# Altium schematic sheet config-bank1.SchDoc: Config FPGA - Bank 1
size Letter; CheckedBy: E. Chiu; CompanyName: Brinton Engineering, LLC; DrawnBy: J. Brinton; Engineer: J. Brinton; Address1: 3479 Edison Way; Address2: Menlo Park CA 94025; Address3: +1 (877) 778-8435; Address4: brintonengineering.com; Revision: 1; SheetNumber: 19; SheetTotal: 71
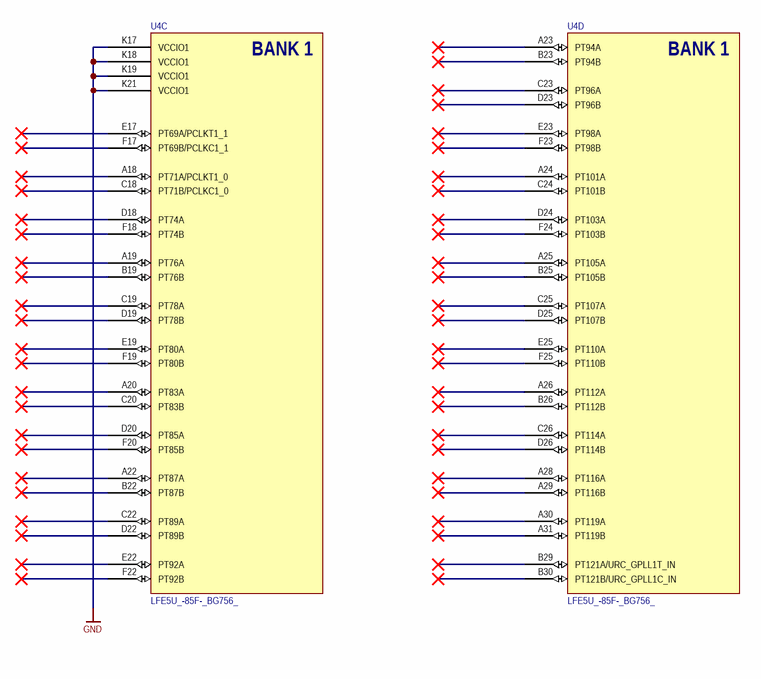
[diagram p0: config-bank1.SchDoc]

## Parts
U4  LFE5U_-85F-_BG756_  [caBGA756]  (parts C,D of 19)

## Nets
GND: U4.K17(VCCIO1) U4.K18(VCCIO1) U4.K19(VCCIO1) U4.K21(VCCIO1)

Not connected (* = marked no-connect by the designer): U4 A18(PT71A/PCLKT1_0)* A19(PT76A)* A20(PT83A)* A22(PT87A)* A23(PT94A)* A24(PT101A)* A25(PT105A)* A26(PT112A)* A28(PT116A)* A29(PT116B)* A30(PT119A)* A31(PT119B)* B19(PT76B)* B22(PT87B)* B23(PT94B)* B25(PT105B)* B26(PT112B)* B29(PT121A/URC_GPLL1T_IN)* B30(PT121B/URC_GPLL1C_IN)* C18(PT71B/PCLKC1_0)* C19(PT78A)* C20(PT83B)* C22(PT89A)* C23(PT96A)* C24(PT101B)* C25(PT107A)* C26(PT114A)* D18(PT74A)* D19(PT78B)* D20(PT85A)* D22(PT89B)* D23(PT96B)* D24(PT103A)* D25(PT107B)* D26(PT114B)* E17(PT69A/PCLKT1_1)* E19(PT80A)* E22(PT92A)* E23(PT98A)* E25(PT110A)* F17(PT69B/PCLKC1_1)* F18(PT74B)* F19(PT80B)* F20(PT85B)* F22(PT92B)* F23(PT98B)* F24(PT103B)* F25(PT110B)*

## Notes on the sheet
- Title
- Engineer
- Revision
- Drawn By
- Checked By
- Date
- Sheet
- of
- (in symbol LFE5U_-85F-_BG756_, part C) BANK 1
- (in symbol LFE5U_-85F-_BG756_, part D) BANK 1

## Library data of the parts
U4 = LFE5U_-85F-_BG756_: ECP5 FPGA, 85k LUT, 756-caBGA; Manufacturer: Lattice Semiconductor; Manufacturer P/N: LFE5U_-85F-_BG756_